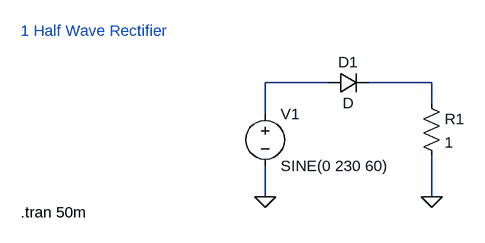
[diagram p0: schematic 1HalfRectirie.asc]
1HalfRectirie.asc, the LTspice schematic file:
Version 4.1
SHEET 1 880 680
WIRE 208 96 112 96
WIRE 368 96 272 96
WIRE 368 128 368 96
WIRE 112 144 112 96
WIRE 112 272 112 224
WIRE 368 272 368 208
FLAG 112 272 0
FLAG 368 272 0
SYMBOL res 352 112 R0
SYMATTR InstName R1
SYMATTR Value 1
SYMBOL diode 208 112 R270
WINDOW 0 32 32 VTop 2
WINDOW 3 0 32 VBottom 2
SYMATTR InstName D1
SYMBOL voltage 112 128 R0
WINDOW 123 0 0 Left 0
WINDOW 39 0 0 Left 0
SYMATTR InstName V1
SYMATTR Value SINE(0 230 60)
TEXT -264 16 Left 2 ;1 Half Wave Rectifier
TEXT -264 296 Left 2 !.tran 50m

The netlist it stands for:
* 1HalfRectirie.asc
R1 N002 0 1
D1 N001 N002 D
V1 N001 0 SINE(0 230 60)
.model D D
.lib standard.dio
* 1 Half Wave Rectifier
.tran 50m
.backanno
.end